# Altium schematic sheet LORA.SchDoc
size A; SheetNumber: 5; SheetTotal: 5
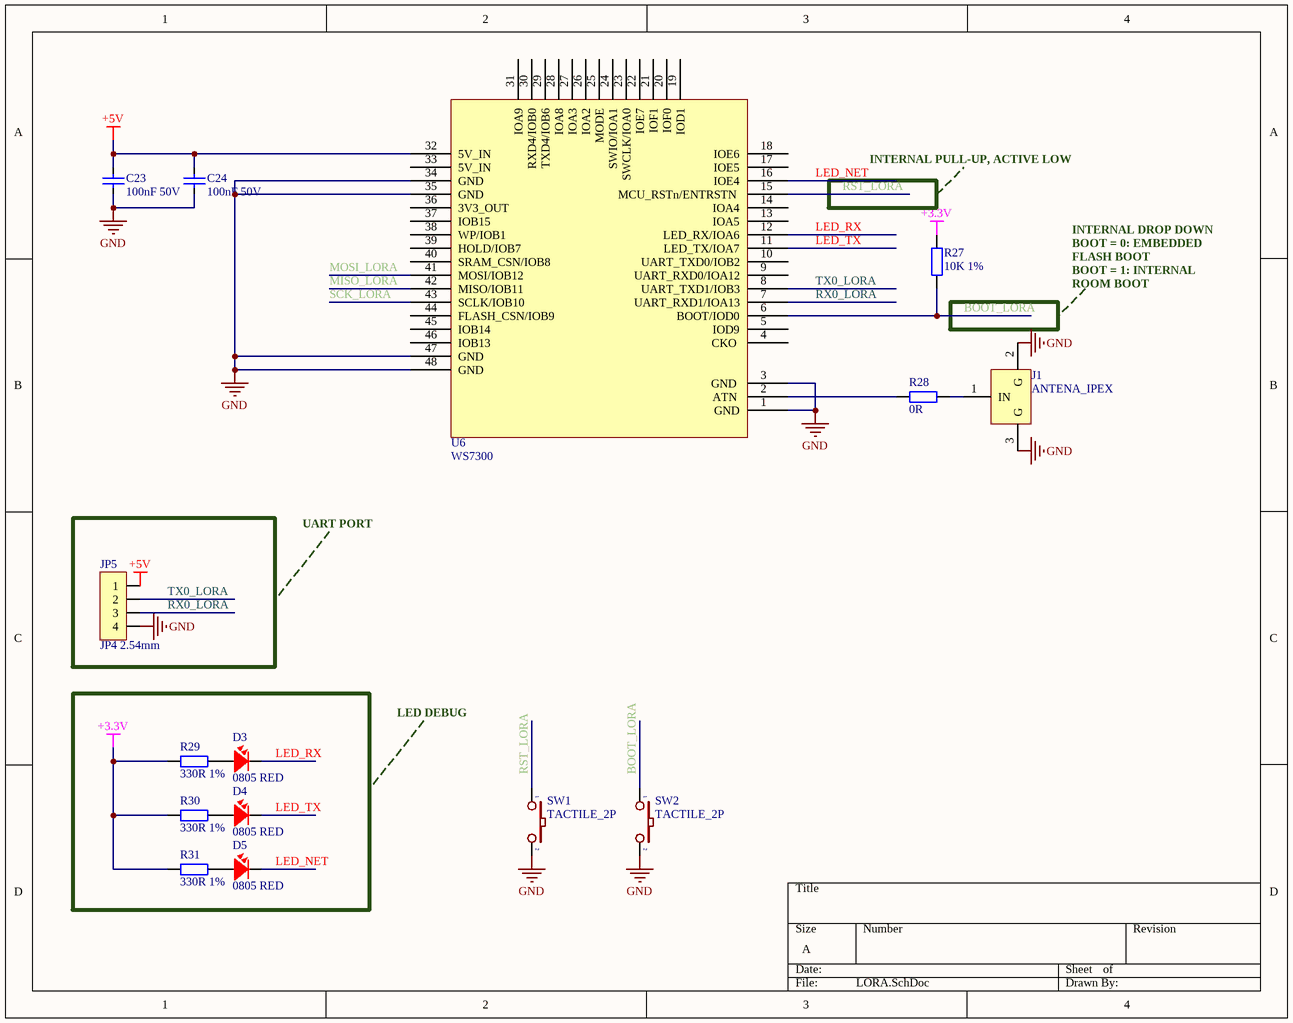
[diagram p0: LORA.SchDoc]

## Parts
C23  100nF 50V  [CAP_SMD_0805]
C24  100nF 50V  [CAP_SMD_0805]
D3  0805 RED  [LED-0805-Red]
D4  0805 RED  [LED-0805-Red]
D5  0805 RED  [LED-0805-Red]
J1  ANTENA_IPEX  [IPEX]
JP5  JP4 2.54mm  [JP4_M]
R27  10K 1%  [RES_SMD_0805]
R28  0R  [RES_SMD_0805]
R29  330R 1%  [RES_SMD_0805]
R30  330R 1%  [RES_SMD_0805]
R31  330R 1%  [RES_SMD_0805]
SW1  TACTILE_2P  [C&K BUTTON 2P]
SW2  TACTILE_2P  [C&K BUTTON 2P]
U6  WS7300  [WS7300-S]

## Nets
+3.3V: R27.2 R29.1 R30.1 R31.1
+5V: C23.2 C24.2 JP5.1 U6.32(5V_IN)
GND: C23.1 C24.1 J1.2(G) J1.3(G) JP5.4 SW1.2 SW2.2 U6.1(GND) U6.3(GND) U6.34(GND) U6.35(GND) U6.47(GND) U6.48(GND)
BOOT_LORA: R27.1 SW2.1 U6.6(BOOT/IOD0)
LED_NET: D5.2 U6.16(IOE4)
LED_RX: D3.2 U6.12(LED_RX/IOA6)
LED_TX: D4.2 U6.11(LED_TX/IOA7)
MISO_LORA : U6.42(MISO/IOB11)
MOSI_LORA : U6.41(MOSI/IOB12)
RST_LORA: SW1.1 U6.15(MCU_RSTn/ENTRSTN)
RX0_LORA: JP5.3 U6.7(UART_RXD1/IOA13)
SCK_LORA: U6.43(SCLK/IOB10)
TX0_LORA: JP5.2 U6.8(UART_TXD1/IOB3)
NetD3_1: D3.1 R29.2
NetD4_1: D4.1 R30.2
NetD5_1: D5.1 R31.2
NetJ1_1: J1.1(IN) R28.2
NetR28_1: R28.1 U6.2(ATN)

Not connected (* = marked no-connect by the designer): U6 4(CKO_) 5(IOD9) 9(UART_RXD0/IOA12) 10(UART_TXD0/IOB2) 13(IOA5) 14(IOA4) 17(IOE5) 18(IOE6) 19(IOD1) 20(IOF0) 21(IOF1) 22(IOE7) 23(SWCLK/IOA0) 24(SWIO/IOA1) 25(MODE) 26(IOA2) 27(IOA3) 28(IOA8) 29(TXD4/IOB6) 30(RXD4/IOB0) 31(IOA9) 33(5V_IN) 36(3V3_OUT) 37(IOB15) 38(WP/IOB1) 39(HOLD/IOB7) 40(SRAM_CSN/IOB8) 44(FLASH_CSN/IOB9) 45(IOB14) 46(IOB13)

## Notes on the sheet
- INTERNAL PULL-UP, ACTIVE LOW
- INTERNAL DROP DOWN
  BOOT = 0: EMBEDDED FLASH BOOT
  BOOT = 1: INTERNAL ROOM BOOT
- UART PORT
- LED DEBUG

## Library data of the parts
C23 C24 = C0805_MLCC_100nF_50V: 0.1 µF ±10% 50V Ceramic Capacitor X7R 0805 (2012 Metric); Manufacturer: YAGEO; Manufacture Part Number: CC0805KRX7R9BB104; Packaging: Cut Tape (CT); Link: https://www.digikey.cn/en/products/detail/yageo/CC0805KRX7R9BB104/302874; Price: $0.10
D3-D5 = LED_0805_RED: Red 625nm LED Indication - Discrete 2V 0805 (2012 Metric); Manufacturer: Würth Elektronik; Manufacture Part Number: 150080RS75000; Packaging: Cut Tape (CT); Link: https://www.digikey.cn/en/products/detail/w%C3%BCrth-elektronik/150080RS75000/4489918; Price: $0.19
J1 = ANTENA_IPEX: U.FL (UMCC), IPEX MHFI Connector Receptacle, Male Pin Surface Mount Solder; Manufacturer: I-PEX; Manufacture Part Number: 20279-001E-03; Packaging: Cut Tape (CT); Link: https://www.digikey.com/en/products/detail/i-pex/20279-001E-03/22108814; Price: $1.77
JP5 = JP4M: Connector Header Through Hole 4 position 0.100" (2.54mm); Manufacturer: Würth Elektronik; Manufacture Part Number: 61300411121; Packaging: Bulk; Link: https://www.digikey.cn/en/products/detail/w%C3%BCrth-elektronik/61300411121/4846827?s=N4IgTCBcDaIGwEYDMAGFAWBWwJAXQF8g; Price: $0.19
R27 = R0805_10K: 10 kOhms ±1% 0.125W, 1/8W Chip Resistor 0805 (2012 Metric) Moisture Resistant Thick Film; Manufacturer: YAGEO; Manufacture Part Number: RC0805FR-0710KL; Packaging: Cut Tape (CT); Price: $0.10; Link: https://www.digikey.cn/en/products/detail/yageo/RC0805FR-0710KL/727535
R28 = R0805_0R: 0 Ohms Jumper Chip Resistor 0805 (2012 Metric) Automotive AEC-Q200 Thick Film; Manufacturer: Vishay Dale; Manufacture Part Number: CRCW08050000Z0EA; Packaging: Cut Tape (CT); Link: https://www.digikey.cn/en/products/detail/vishay-dale/CRCW08050000Z0EA/1175125; Price: $0.10
R29-R31 = R0805_330R: 330 Ohms ±1% 0.125W, 1/8W Chip Resistor 0805 (2012 Metric) Automotive AEC-Q200 Thick Film; Manufacturer: Stackpole Electronics Inc; Manufacture Part Number: RMCF0805FT330R; Packaging: Cut Tape (CT); Link: https://www.digikey.cn/en/products/detail/stackpole-electronics-inc/RMCF0805FT330R/1760484; Price: $0.10
SW1 SW2 = SWITCH_TACTILE_2P: Tactile Switch SPST-NO Top Actuated Surface Mount; Manufacturer: C&K; Manufacture Part Number: PTS636 SM43 SMTR LFS; Packaging: Cut Tape (CT); Link: https://www.digikey.com/en/products/detail/c-k/PTS636-SM43-SMTR-LFS/10071723; Price: $0.19
U6 = WS7300: Wi-SUN wireless communication modules based on the VC7300BU chip from Lireda; Manufacturer: Lireda; Manufacture Part Number: WS7300